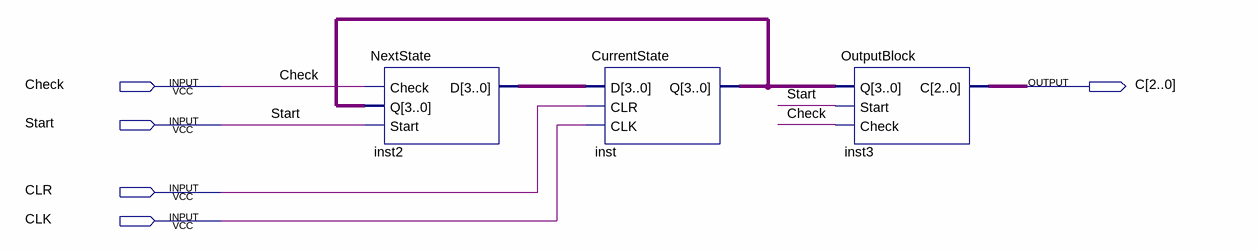
[diagram p0: schematic sheet]
// Quartus schematic Control.bdf as structural Verilog: 3 symbols, 5 pins
module Control (
  input  Check,
  input  Start,
  input  CLR,
  input  CLK,
  output [2:0] C
);

  wire [3:0] inst2_d, inst_q;

  NextState inst2 (.Check(Check), .Q(inst_q), .Start(Start), .D(inst2_d));
  CurrentState inst (.D(inst2_d), .CLR(CLR), .CLK(CLK), .Q(inst_q));
  OutputBlock inst3 (.Q(inst_q), .Start(Start), .Check(Check), .C(C));
endmodule
